# EAGLE schematic Wroom_board3motor (EAGLE 9.1.3)
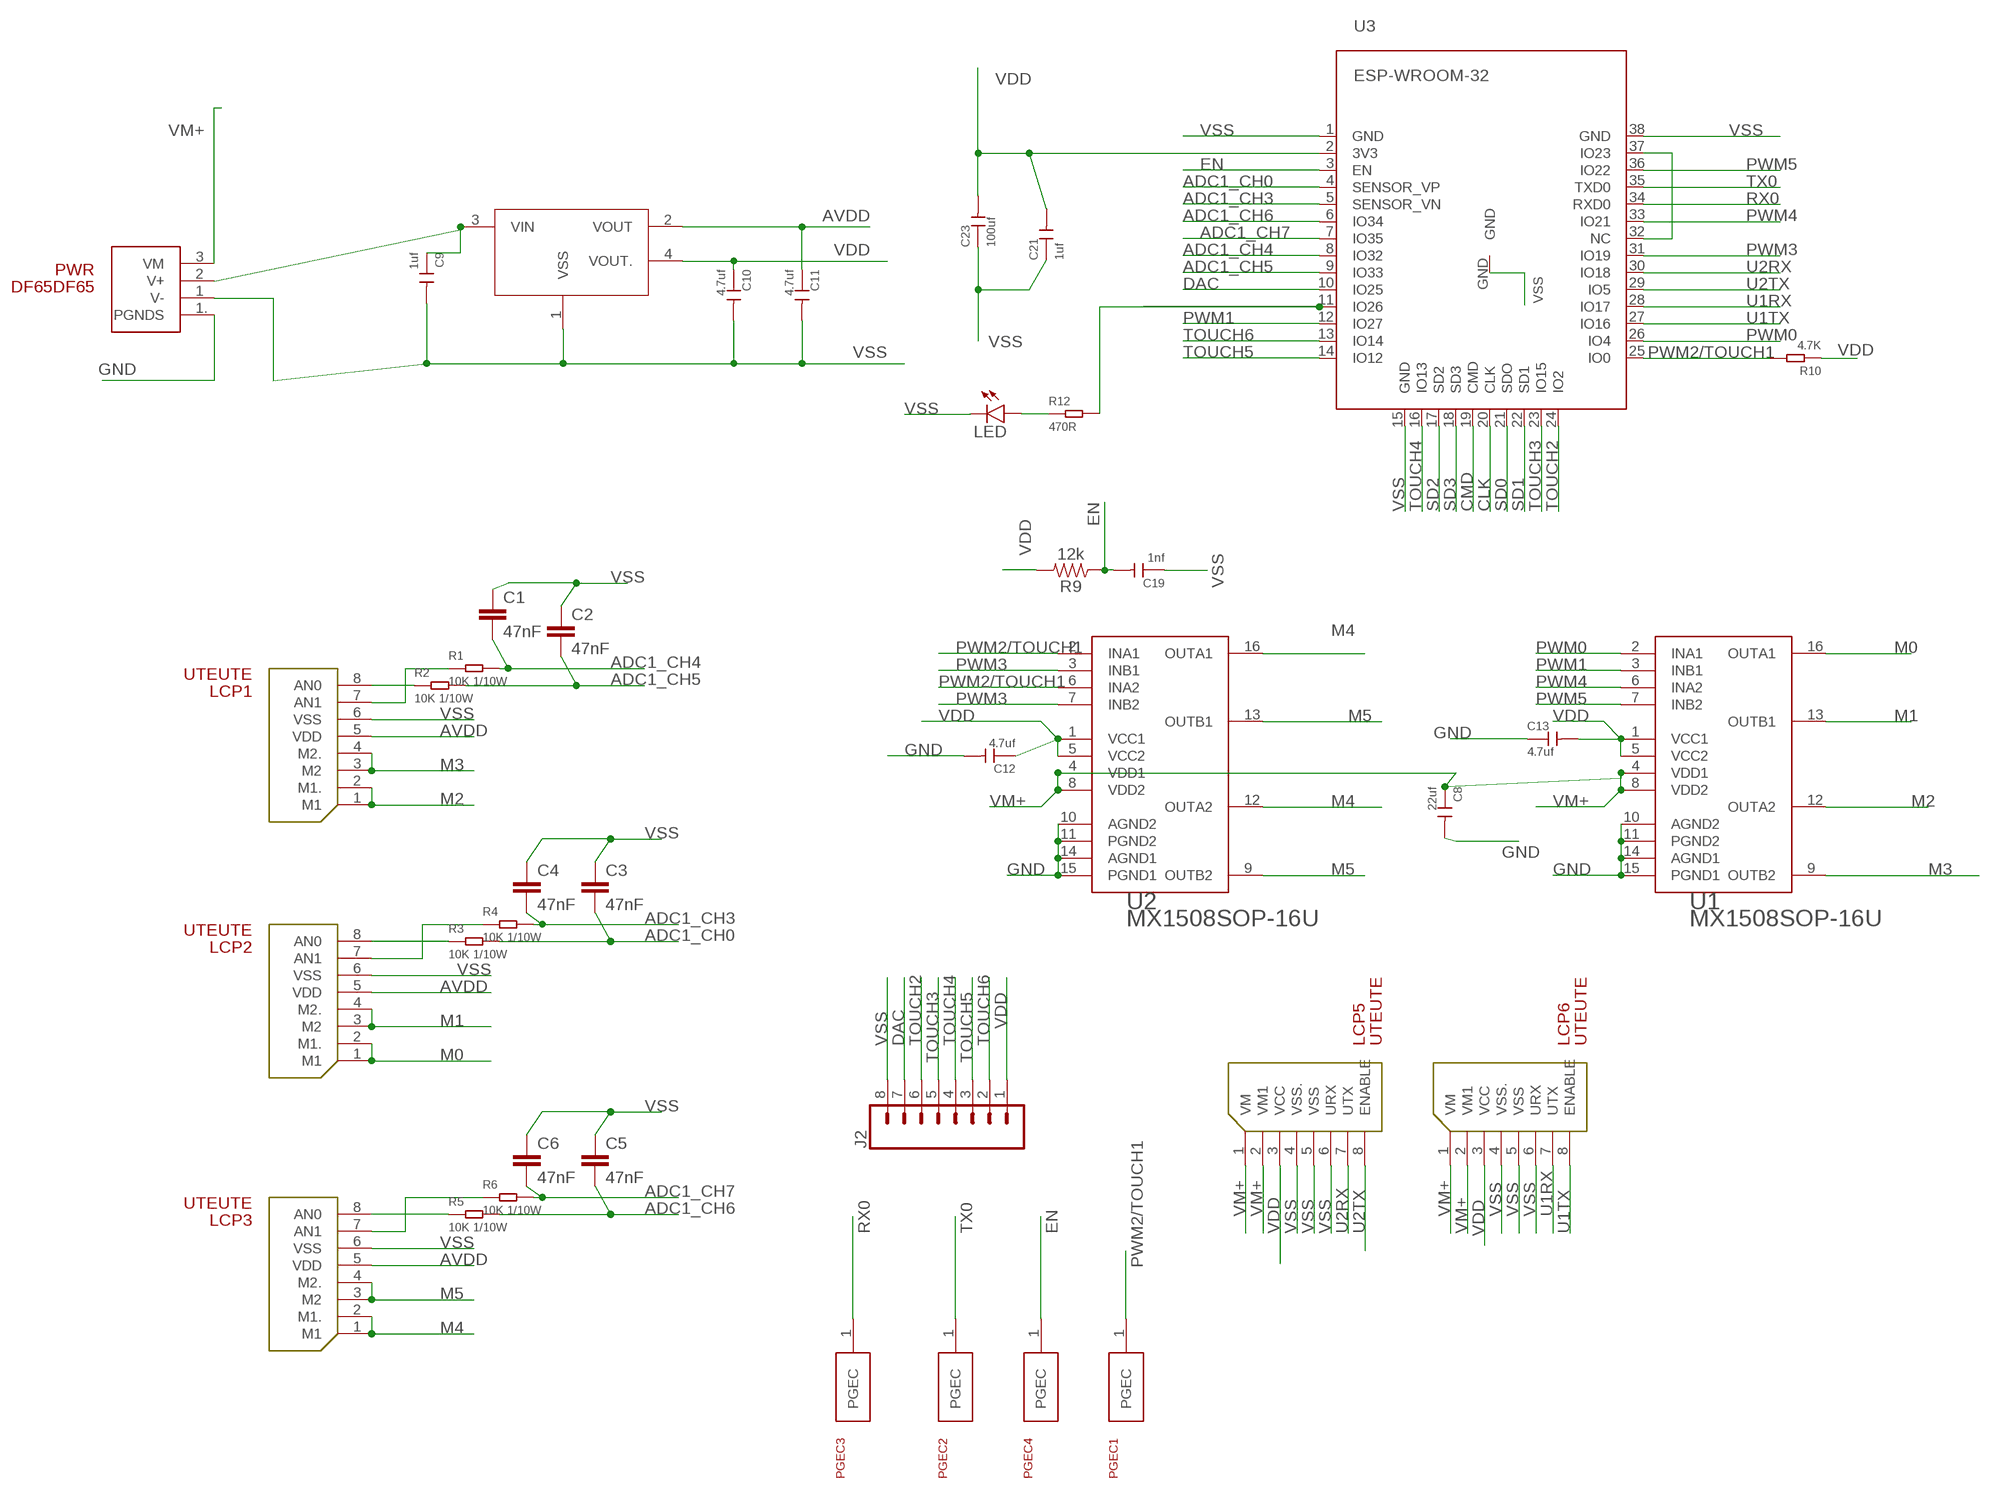
[diagram p0: schematic, sheet 1]

## Parts
C1  47nF  47NF-0603-25V-5%  [0603]
C2  47nF  47NF-0603-25V-5%  [0603]
C3  47nF  47NF-0603-25V-5%  [0603]
C4  47nF  47NF-0603-25V-5%  [0603]
C5  47nF  47NF-0603-25V-5%  [0603]
C6  47nF  47NF-0603-25V-5%  [0603]
C8  22uf  CERAMIC-22UF-6.3V-20%-X5R(0805)  [C0805]
C9  1uf  CERAMIC-1UF-25V-10%-X7R(0603)  [C0603]
C10  4.7uf  CERAMIC-4.7UF-10V-10%-X5R(0603)  [C0603]
C11  4.7uf  CERAMIC-4.7UF-10V-10%-X5R(0603)  [C0603]
C12  4.7uf  CERAMIC-4.7UF-10V-10%-X5R(0603)  [C0603]
C13  4.7uf  CERAMIC-4.7UF-10V-10%-X5R(0603)  [C0603]
C19  1nf  CERAMIC-1NF-50V-5%-C0G(0603)  [C0603]
C21  1uf  CERAMIC-1UF-25V-10%-X7R(0603)  [C0603]
C23  100uf  CERAMIC-100UF-6.3V-20%-X5R(1206)  [C1206]
J2  CONN_08"  [1X08]
LCP1  UTEUTE  [UTE]
LCP2  UTEUTE  [UTE]
LCP3  UTEUTE  [UTE]
LCP5  UTEUTE  [UTE]
LCP6  UTEUTE  [UTE]
LED  LEDCHIP-LED0603  [CHIP-LED0603]
PGEC1  PGECPGEC  [PGEC]
PGEC2  PGECPGEC  [PGEC]
PGEC3  PGECPGEC  [PGEC]
PGEC4  PGECPGEC  [PGEC]
PWR  DF65DF65  [DF65]
R1  10K 1/10W  SMD-RES-10K-5%-1/10W(0603)  [R0603]
R2  10K 1/10W  SMD-RES-10K-5%-1/10W(0603)  [R0603]
R3  10K 1/10W  SMD-RES-10K-5%-1/10W(0603)  [R0603]
R4  10K 1/10W  SMD-RES-10K-5%-1/10W(0603)  [R0603]
R5  10K 1/10W  SMD-RES-10K-5%-1/10W(0603)  [R0603]
R6  10K 1/10W  SMD-RES-10K-5%-1/10W(0603)  [R0603]
R9  12k  12KOHM-0603-1/10W-1%  [0603]
R10  4.7K  SMD-RES-4.7K-5%-1/10W(0603)  [R0603]
R12  470R  SMD-RES-470R-5%-1/10W(0603)  [R0603]
U1  MX1508SOP-16U  [MX1508SOP-16]
U2  MX1508SOP-16U  [MX1508SOP-16]
U3  ESP-WROOM-32  [ESP-WROOM-32]
U4  SOT230P700X180-4NLDL1117  [SOT230P700X180-4N]

## Nets
ADC1_CH0: C3.2 R3.2 U3.4(SENSOR_VP)
ADC1_CH3: C4.2 R4.2 U3.5(SENSOR_VN)
ADC1_CH4: C1.2 R1.2 U3.8(IO32)
ADC1_CH5: C2.2 R2.2 U3.9(IO33)
ADC1_CH6: C5.2 R5.2 U3.6(IO34)
ADC1_CH7: C6.2 R6.2 U3.7(IO35)
AVDD [power]: C11.1 LCP1.5(VDD) LCP2.5(VDD) LCP3.5(VDD) U4.2(VOUT)
CLK: U3.20(CLK)
CMD: U3.19(CMD)
DAC: J2.7 U3.10(IO25)
DAC2: R12.2 U3.11(IO26)
EN: C19.2 PGEC4.1(PGEC) R9.1 U3.3(EN)
GND: C8.2 C12.2 C13.1 PWR.1.(PGNDS) U1.10(AGND2) U1.11(PGND2) U1.14(AGND1) U1.15(PGND1) U2.10(AGND2) U2.11(PGND2) U2.14(AGND1) U2.15(PGND1)
IO23: U3.32(NC) U3.37(IO23)
M0 [motor line]: LCP2.1(M1) LCP2.2(M1.) U1.16(OUTA1)
M1 [motor line]: LCP2.3(M2) LCP2.4(M2.) U1.13(OUTB1)
M2 [motor line]: LCP1.1(M1) LCP1.2(M1.) U1.12(OUTA2)
M3 [motor line]: LCP1.3(M2) LCP1.4(M2.) U1.9(OUTB2)
M4 [motor line]: LCP3.1(M1) LCP3.2(M1.) U2.12(OUTA2) U2.16(OUTA1)
M5 [motor line]: LCP3.3(M2) LCP3.4(M2.) U2.9(OUTB2) U2.13(OUTB1)
N$1: LCP1.8(AN0) R2.1
N$3: C9.1 PWR.2(V+) U4.3(VIN)
N$4: LCP3.7(AN1) R6.1
N$5: LED.A R12.1
N$6: LCP2.8(AN0) R3.1
N$8: LCP3.8(AN0) R5.1
N$9: LCP2.7(AN1) R4.1
N$10: LCP1.7(AN1) R1.1
PWM0: U1.2(INA1) U3.26(IO4)
PWM1: U1.3(INB1) U3.12(IO27)
PWM2/TOUCH1: PGEC1.1(PGEC) R10.2 U2.2(INA1) U2.6(INA2) U3.25(IO0)
PWM3: U2.3(INB1) U2.7(INB2) U3.31(IO19)
PWM4: U1.6(INA2) U3.33(IO21)
PWM5: U1.7(INB2) U3.36(IO22)
RX0: PGEC3.1(PGEC) U3.34(RXD0)
SD0: U3.21(SDO)
SD1: U3.22(SD1)
SD2: U3.17(SD2)
SD3: U3.18(SD3)
TOUCH2: J2.6 U3.24(IO2)
TOUCH3: J2.5 U3.23(IO15)
TOUCH4: J2.4 U3.16(IO13)
TOUCH5: J2.3 U3.14(IO12)
TOUCH6: J2.2 U3.13(IO14)
TX0: PGEC2.1(PGEC) U3.35(TXD0)
U1RX: LCP6.7(UTX) U3.28(IO17)
U1TX: LCP6.8(ENABLE) U3.27(IO16)
U2RX: LCP5.7(UTX) U3.30(IO18)
U2TX: LCP5.8(ENABLE) U3.29(IO5)
VDD [power]: C10.1 C12.1 C13.2 C21.2 C23.2 J2.1 LCP5.3(VCC) LCP6.3(VCC) R9.2 R10.1 U1.1(VCC1) U1.5(VCC2) U2.1(VCC1) U2.5(VCC2) U3.2(3V3) U4.4(VOUT.)
VM+ [motor line]: C8.1 LCP5.1(VM) LCP5.2(VM1) LCP6.1(VM) LCP6.2(VM1) PWR.3(VM) U1.4(VDD1) U1.8(VDD2) U2.4(VDD1) U2.8(VDD2)
VSS [power]: C1.1 C2.1 C3.1 C4.1 C5.1 C6.1 C9.2 C10.2 C11.2 C19.1 C21.1 C23.1 J2.8 LCP1.6(VSS) LCP2.6(VSS) LCP3.6(VSS) LCP5.4(VSS.) LCP5.5(VSS) LCP5.6(URX) LCP6.4(VSS.) LCP6.5(VSS) LCP6.6(URX) LED.C PWR.1(V-) U3.1(GND) U3.15(GND) U3.38(GND) U3.GND U4.1(VSS)

## Library data of the parts
C1-C6 = SparkFun-Capacitors:47NF: 47nF ceramic capacitors A capacitor is a passive two-terminal electrical component used to store electrical energy temporarily in an electric field.; PROD_ID: CAP-08605
C8 = Seeed-Capacitor:CERAMIC-22UF-6.3V-20%-X5R(0805): 302010171; MPN: CC0805MKX5R5BB226
C9 C21 = Seeed-Capacitor:CERAMIC-1UF-25V-10%-X7R(0603): 302010139; MPN: CC0603KRX7R8BB105
C10-C13 = Seeed-Capacitor:CERAMIC-4.7UF-10V-10%-X5R(0603): 302010111; MPN: CC0603KRX5R6BB475
C19 = Seeed-Capacitor:CERAMIC-1NF-50V-5%-C0G(0603): 302010341; MPN: GRM1885C1H102JA01D
C23 = Seeed-Capacitor:CERAMIC-100UF-6.3V-20%-X5R(1206): 302010183; MPN: GRM31CR60J107ME39L
J2 = SparkFun-Connectors:CONN_08: Multi connection point. Often used as Generic Header-pin footprint for 0.1 inch spaced/style header connections On any of the 0.1 inch spaced packages, you can populate with these: Break Away Headers - Straight <https://www.sparkfun.com/products/116> (PRT-00116) Break Away Male Headers - Right Angle <https://www.sparkfun.com/products/553> (PRT-00553) Female Headers <https://www.sparkfun.com/products/115> (PRT-00115) Break Away Headers - Machine Pin <https://www.sparkfun.com/products/117> (PRT-00117) Break Away Female Headers - Swiss Machine Pin <https://www.sparkfun.com/products/743> (PRT-00743) Arduino Stackable Header - 8 Pin <https://www.sparkfun.com/products/9279> (PRT-09279) For SCREWTERMINALS and SPRING TERMINALS visit here: Screw Terimnals on SparkFun.com <https://www.sparkfun.com/search/results?term=Screw+Terminals> (5mm/3.5mm/2.54mm spacing) This device is also useful as a general connection point to wire up your design to another part of your project. Our various solder wires solder well into these plated through hole pads. Hook-Up Wire - Assortment (Stranded, 22 AWG) <https://www.sparkfun.com/products/11375> (PRT-11375) Hook-Up Wire - Assortment (Solid Core, 22 AWG) <https://www.sparkfun.com/products/11367> (PRT-11367) View the entire wire category on our website here <https://www.sparkfun.com/categories/141> Special notes: Molex polarized connector foot print use with SKU : PRT-08231 with associated crimp pins and housings. 1MM SMD Version SKU: PRT-10208 NOTES ON THE VARIANTS LOCK and LOCK_LONGPADS... This footprint was designed to help hold the alignment of a through-hole component (i.e. 6-pin header) while soldering it into place. You may notice that each hole has been shifted either up or down by 0.005 of an inch from it's more standard position (which is a perfectly straight line). This slight alteration caused the pins (the squares in the middle) to touch the edges of the holes. Because they are alternating, it causes a "brace" to hold the component in place. 0.005 has proven to be the perfect amount of "off-center" position when using our standard breakaway headers. Although looks a little odd when you look at the bare footprint, once you have a header in there, the alteration is very hard to notice. Also,if you push a header all the way into place, it is covered up entirely on the bottom side.; PROD_ID: CONN-08438
LCP1-LCP3 = ute5526:UTE
LCP5 LCP6 = ute5526(uart):UTE
LED = led:LED: LED OSRAM: - CHIPLED LG R971, LG N971, LY N971, LG Q971, LY Q971, LO R971, LY R971 LH N974, LH R974 LS Q976, LO Q976, LY Q976 LO Q996 - Hyper CHIPLED LW Q18S LB Q993, LB Q99A, LB R99A - SideLED LS A670, LO A670, LY A670, LG A670, LP A670 LB A673, LV A673, LT A673, LW A673 LH A674 LY A675 LS A676, LA A676, LO A676, LY A676, LW A676 LS A679, LY A679, LG A679 - Hyper Micro SIDELED® LS Y876, LA Y876, LO Y876, LY Y876 LT Y87S - SmartLED LW L88C, LW L88S LB L89C, LB L89S, LG L890 LS L89K, LO L89K, LY L89K LS L896, LA L896, LO L896, LY L896 - TOPLED LS T670, LO T670, LY T670, LG T670, LP T670 LSG T670, LSP T670, LSY T670, LOP T670, LYG T670 LG T671, LOG T671, LSG T671 LB T673, LV T673, LT T673, LW T673 LH T674 LS T676, LA T676, LO T676, LY T676, LB T676, LH T676, LSB T676, LW T676 LB T67C, LV T67C, LT T67C, LS T67K, LO T67K, LY T67K, LW E67C LS E67B, LA E67B, LO E67B, LY E67B, LB E67C, LV E67C, LT E67C LW T67C LS T679, LY T679, LG T679 LS T770, LO T770, LY T770, LG T770, LP T770 LB T773, LV T773, LT T773, LW T773 LH T774 LS E675, LA E675, LY E675, LS T675 LS T776, LA T776, LO T776, LY T776, LB T776 LHGB T686 LT T68C, LB T68C - Hyper Mini TOPLED® LB M676 - Mini TOPLED Santana® LG M470 LS M47K, LO M47K, LY M47K Source: http://www.osram.convergy.de LUXEON: - LUMILED® LXK2-PW12-R00, LXK2-PW12-S00, LXK2-PW14-U00, LXK2-PW14-V00 LXK2-PM12-R00, LXK2-PM12-S00, LXK2-PM14-U00 LXK2-PE12-Q00, LXK2-PE12-R00, LXK2-PE12-S00, LXK2-PE14-T00, LXK2-PE14-U00 LXK2-PB12-K00, LXK2-PB12-L00, LXK2-PB12-M00, LXK2-PB14-N00, LXK2-PB14-P00, LXK2-PB14-Q00 LXK2-PR12-L00, LXK2-PR12-M00, LXK2-PR14-Q00, LXK2-PR14-R00 LXK2-PD12-Q00, LXK2-PD12-R00, LXK2-PD12-S00 LXK2-PH12-R00, LXK2-PH12-S00 LXK2-PL12-P00, LXK2-PL12-Q00, LXK2-PL12-R00 Source: www.luxeon.com KINGBRIGHT: KA-3528ASYC Source: www.kingbright.com
PGEC1-PGEC4 = pgec:PGEC: <this is a programming pin for the catchy point means PGEC port>
PWR = df65:DF65: <1.7mm pitch, Low Profile Wire-to-Board Connectors for Power Supplies DF65 series >
R1-R6 = Seeed-Resistor:SMD-RES-10K-5%-1/10W(0603): 301010293; MPN: RC0603JR-0710KL
R9 = SparkFun-Resistors:12KOHM: 12kΩ resistor A resistor is a passive two-terminal electrical component that implements electrical resistance as a circuit element. Resistors act to reduce current flow, and, at the same time, act to lower voltage levels within circuits. - Wikipedia; PROD_ID: RES-10327
R10 = Seeed-Resistor:SMD-RES-4.7K-5%-1/10W(0603): 301010290; MPN: RC0603JR-074K7L
R12 = Seeed-Resistor:SMD-RES-470R-5%-1/10W(0603): 301010088; MPN: RC0603JR-07470RL
U1 U2 = MX1508SOP-16:MX1508SOP-16
U3 = esp32:ESP-WROOM-32
U4 = SOT230P700X180-4N:SOT230P700X180-4N

## Net classes
0 default: width 0.008 mm, drill 0.01 mm, clearance 0.152 mm
1 power: width 0.01 mm, drill 0.011 mm, clearance 0.152 mm
2 motor line: width 0.11 mm, drill 0.011 mm, clearance 0.152 mm